# EAGLE design draft1 (EAGLE 8.4.0)
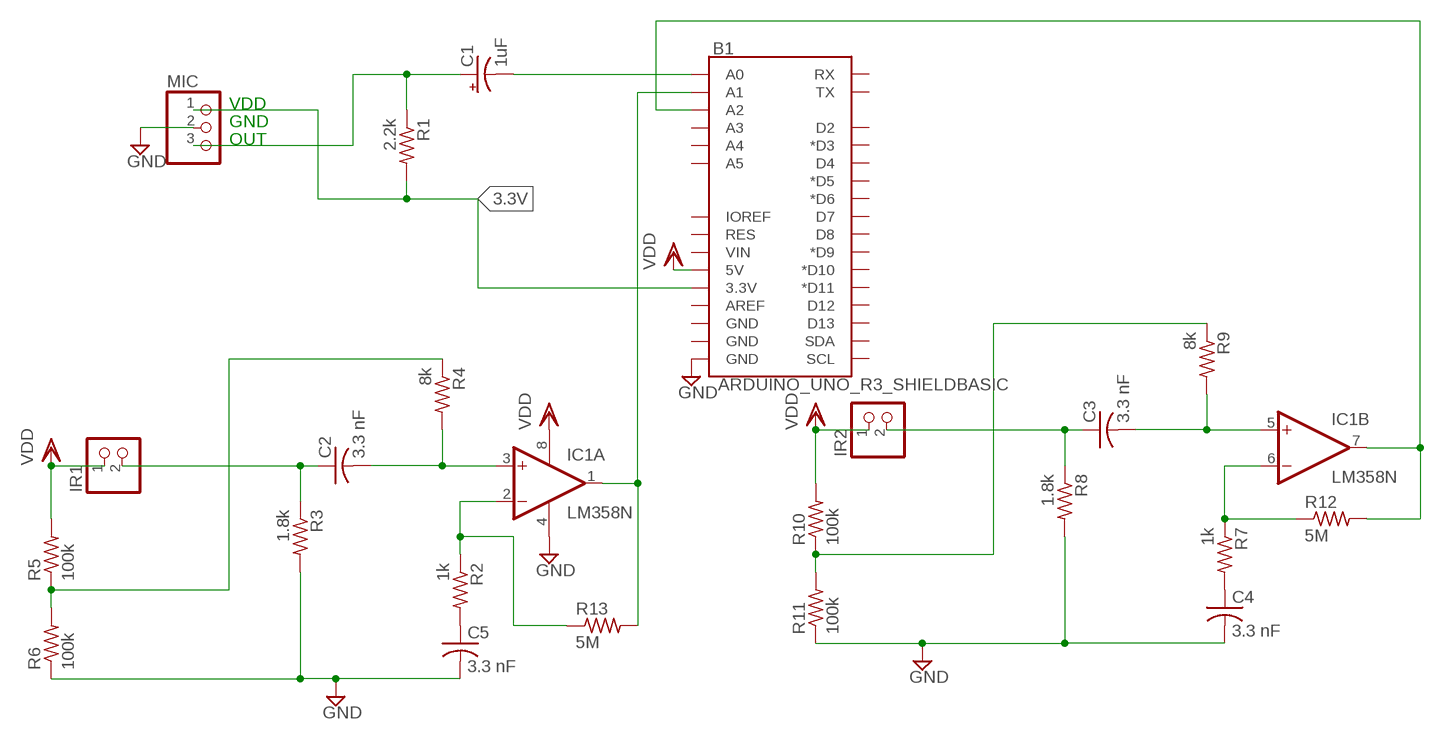
[diagram p0: schematic, sheet 1]

## Parts
B1  ARDUINO_UNO_R3_SHIELDBASIC  [UNO_R3_SHIELD]
C1  1uF  CPOL-USE5-6  [E5-6]
C2  3.3 nF  C-US025-040X050  [C025-040X050]
C3  3.3 nF  C-US025-040X050  [C025-040X050]
C4  3.3 nF  C-US025-040X050  [C025-040X050]
C5  3.3 nF  C-US025-040X050  [C025-040X050]
IC1  LM358N  [DIL08]
IR1  PINHD-1X2  [1X02]
IR2  PINHD-1X2  [1X02]
MIC  PINHD-1X3  [1X03]
R1  2.2k  R-US_0207/7  [0207/7]
R2  1k  R-US_0207/7  [0207/7]
R3  1.8k  R-US_0207/7  [0207/7]
R4  8k  R-US_0207/7  [0207/7]
R5  100k  R-US_0207/7  [0207/7]
R6  100k  R-US_0207/7  [0207/7]
R7  1k  R-US_0207/7  [0207/7]
R8  1.8k  R-US_0207/7  [0207/7]
R9  8k  R-US_0207/7  [0207/7]
R10  100k  R-US_0207/7  [0207/7]
R11  100k  R-US_0207/7  [0207/7]
R12  5M  R-US_0207/7  [0207/7]
R13  5M  R-US_0207/7  [0207/7]

## Nets
3.3V: B1.3.3V MIC.1 R1.2
GND: B1.GND@0(GND) C4.2 C5.2 IC1.4(P:V-) MIC.2 R3.2 R6.1 R8.2 R11.1
N$2: B1.A0 C1.-
N$3: C1.+ MIC.3 R1.1
N$4: B1.A2 IC1.7(B:OUT) R12.2
N$5: C4.1 R7.2
N$6: C3.1 IR2.2 R8.1
N$7: B1.A1 IC1.1(A:OUT) R13.2
N$8: C2.2 IC1.3(A:+IN) R4.2
N$9: IC1.6(B:-IN) R7.1 R12.1
N$11: C3.2 IC1.5(B:+IN) R9.2
N$12: IC1.2(A:-IN) R2.1 R13.1
N$14: R9.1 R10.1 R11.2
N$16: R4.1 R5.1 R6.2
N$17: C5.1 R2.2
N$18: C2.1 IR1.2 R3.1
VDD: B1.5V IC1.8(P:V+) IR1.1 IR2.1 R5.2 R10.2
Unconnected: B1.A3 B1.A4 B1.A5 B1.AREF B1.D2 B1.D3(*D3) B1.D4 B1.D5(*D5) B1.D6(*D6) B1.D7 B1.D8 B1.D9(*D9) B1.D10(*D10) B1.D11(*D11) B1.D12 B1.D13 B1.GND@1(GND) B1.GND@2(GND) B1.IOREF B1.RES B1.RX B1.SCL B1.SDA B1.TX B1.VIN

## Notes on the sheet
- VDD
- GND
- OUT

## Library data of the parts
B1 = SparkFun-Boards:ARDUINO_UNO_R3_SHIELD: Arduino R3 Shield Footprint Shield form compatible with the Arduino Uno R3. SparkFun Products: MG2639 Cellular Shield <https://www.sparkfun.com/products/13120> MIDI Shield <https://www.sparkfun.com/products/12898> R3 Stackable Headers Kit <https://www.sparkfun.com/products/11417>
C1 = resistor:CPOL-US: POLARIZED CAPACITOR, American symbol
C2-C5 = adafruit:C-US: CAPACITOR, American symbol
IC1 = linear:LM358: OP AMP also LM158; LM258; LM2904 Source: http://cache.national.com/ds/LM/LM158.pdf
IR1 IR2 = pinhead:PINHD-1X2: PIN HEADER
MIC = adafruit:PINHD-1X3: PIN HEADER
R1-R4 R7-R9 R12 R13 = rcl:R-US_: RESISTOR, American symbol
R5 R6 R10 R11 = adafruit:R-US_: RESISTOR, American symbol

## Net classes
0 default: width 0.61 mm

## Board
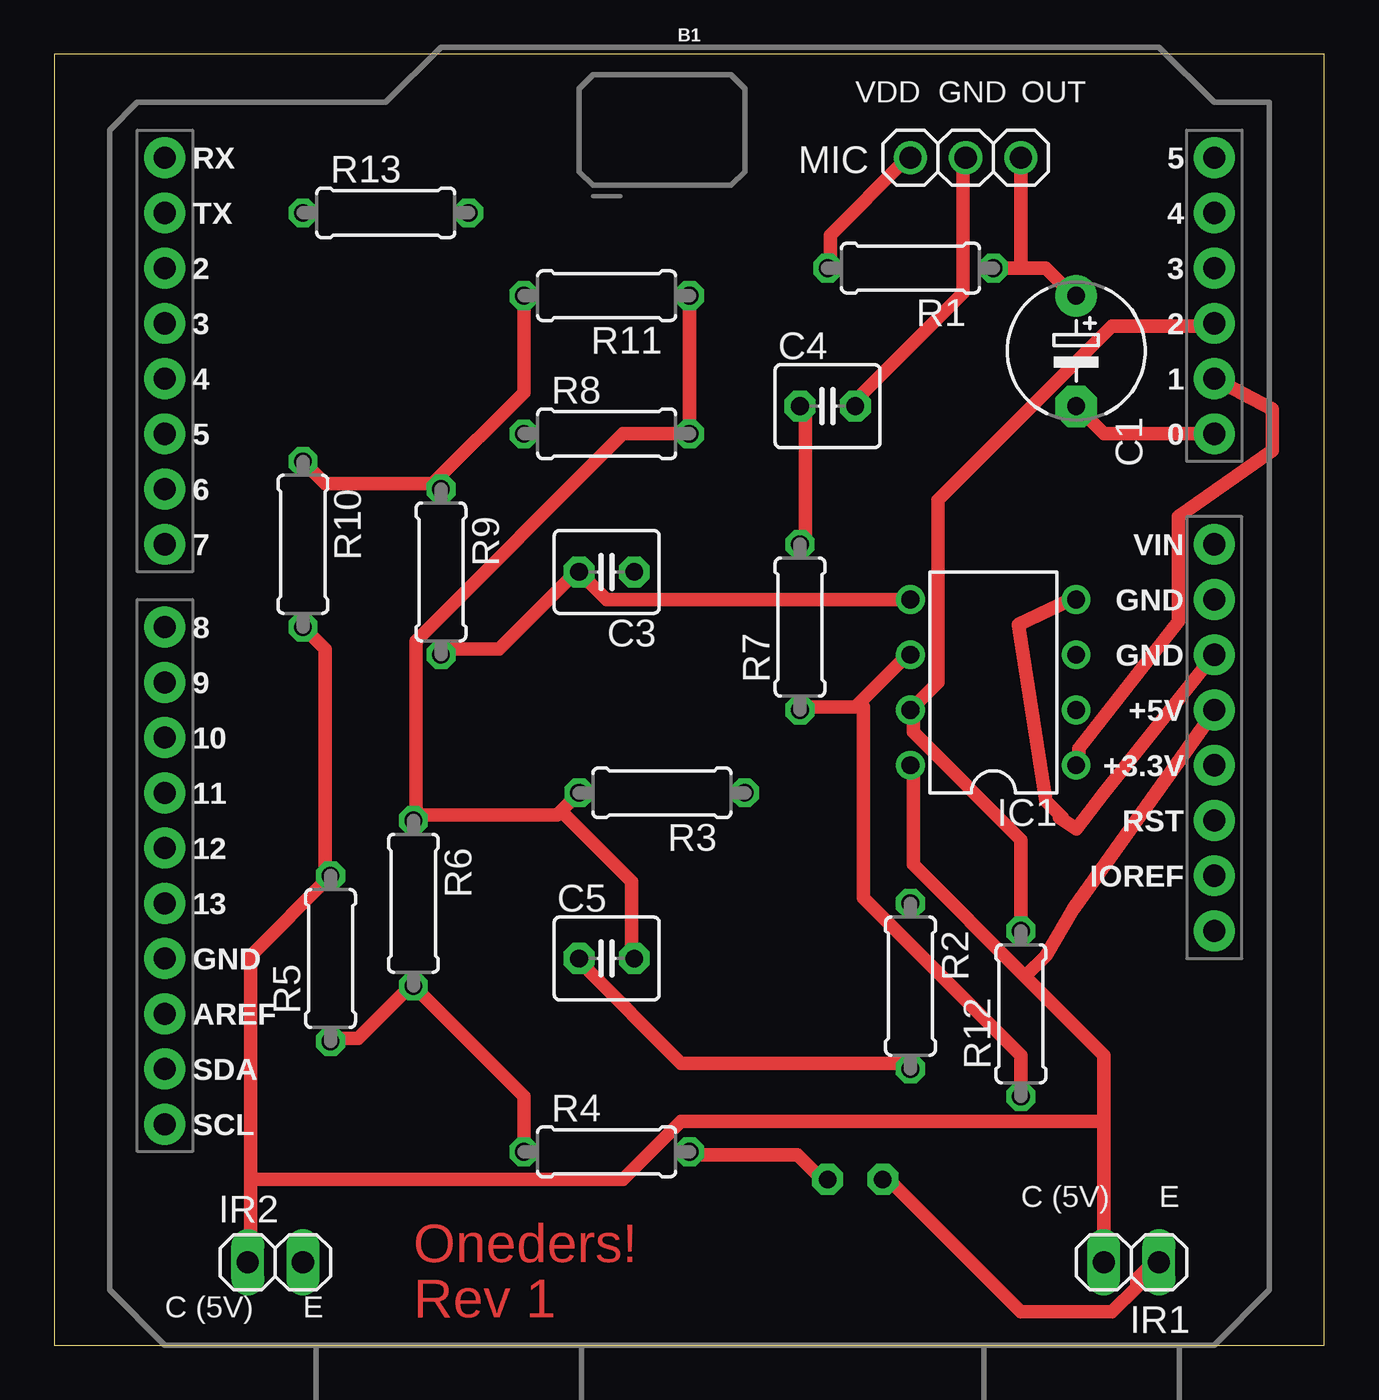
[diagram p1: board, top side]
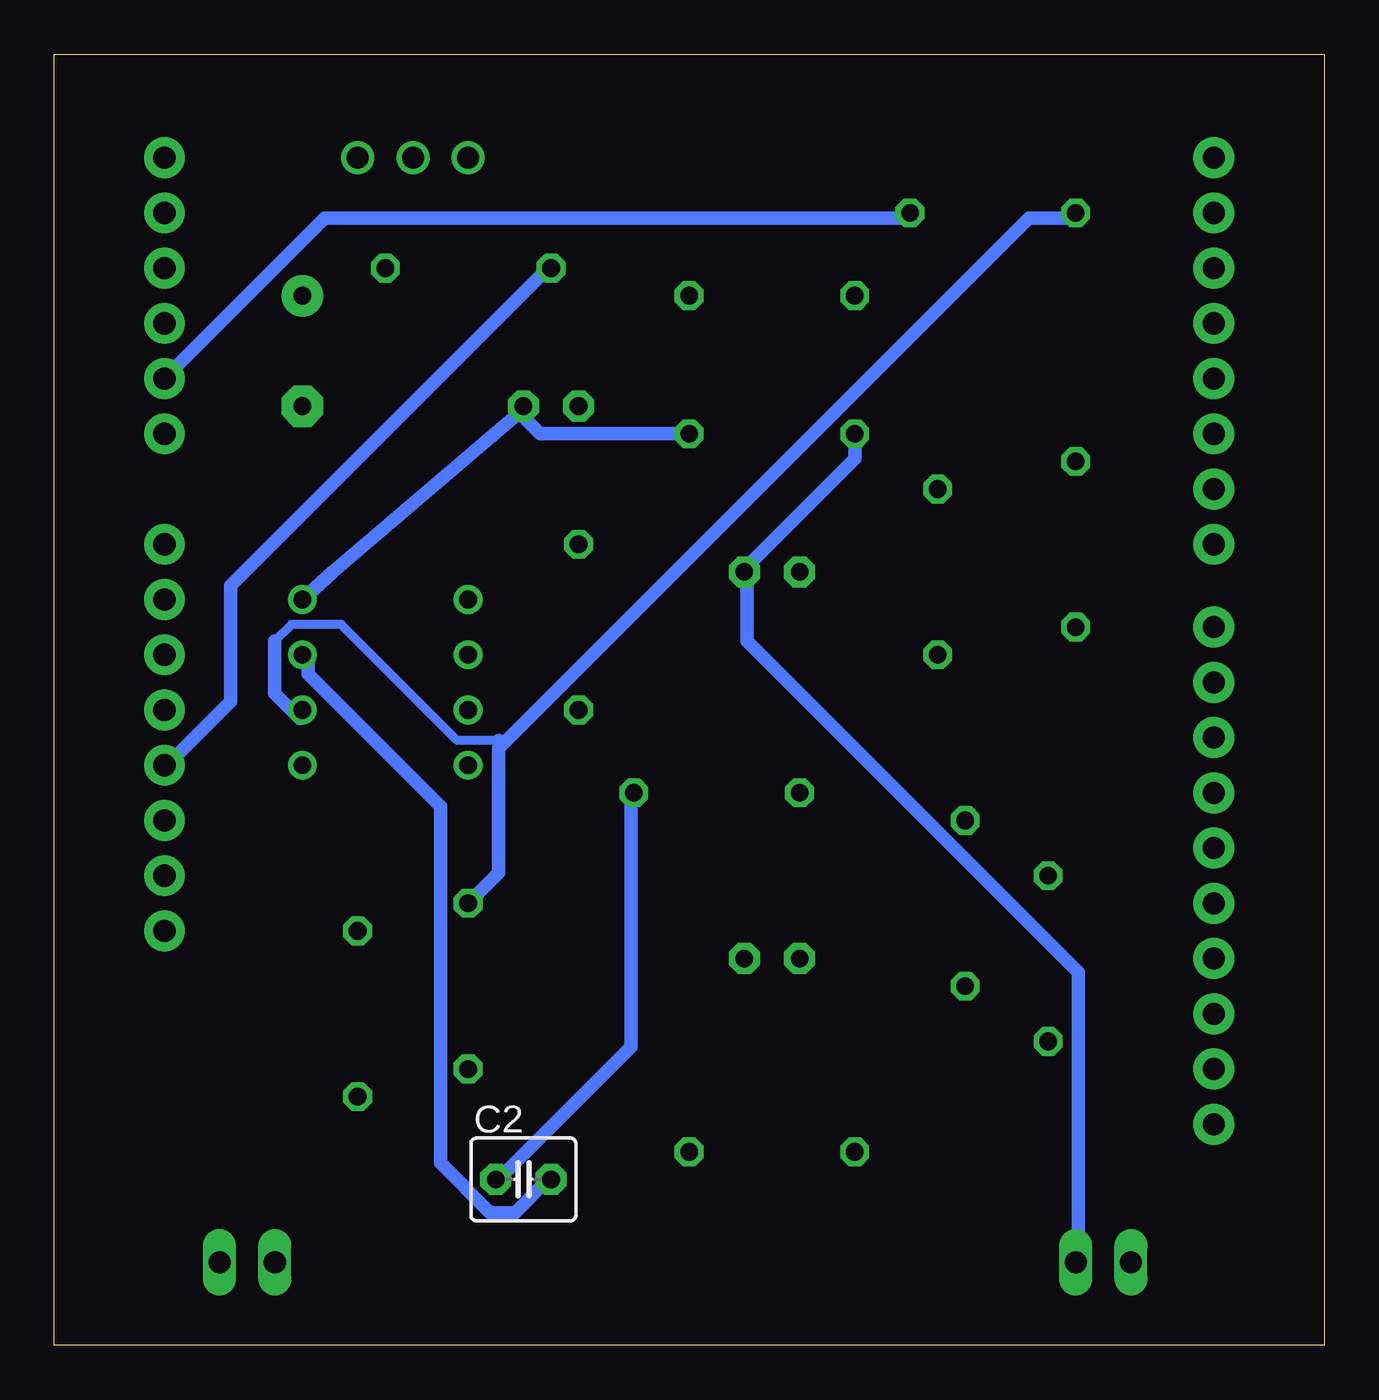
[diagram p2: board, bottom side, seen from below]

Size 58.4 x 59.36 mm. Coordinates in mm from the lower left corner, seen from the top.
Outline: 0,0 58.4,0 58.4,59.36 0,59.36 0,0
Copper layers (1*16): Top 0.035mm / dielectric 1.5mm / Bottom 0.035mm
Design rules "default": minimum track width 6mil, minimum drill 0.35mm, track to track 6mil, track to pad 6mil, pad to pad 6mil, via to via 6mil, smd to smd 6mil, copper to edge 40mil, drill to drill 6mil, minimum pad ring 10mil, minimum via ring 8mil, stop-mask expansion 4mil, vias tented up to drill 0mil, thermal gap 10mil

### Footprints (pad centres in the part's own frame; a part is rotated, then mirrored left to right if it is on the bottom)
UNO_R3_SHIELD = drill 1.016 pad 1.88: 3.3V 24.13,-2.54; 5V 24.13,0; A0 24.13,12.7; A1 24.13,15.24; A2 24.13,17.78; A3 24.13,20.32; A4 24.13,22.86; A5 24.13,25.4; AREF -24.13,-13.97; D2 -24.13,20.32; D3 -24.13,17.78; D4 -24.13,15.24; D5 -24.13,12.7; D6 -24.13,10.16; D7 -24.13,7.62; D8 -24.13,3.81; D9 -24.13,1.27; D10 -24.13,-1.27; D11 -24.13,-3.81; D12 -24.13,-6.35; D13 -24.13,-8.89; GND@0 24.13,2.54; GND@1 24.13,5.08; GND@2 -24.13,-11.43; IOREF 24.13,-7.62; NC 24.13,-10.16; RES 24.13,-5.08; RX -24.13,25.4; SCL -24.13,-19.05; SDA -24.13,-16.51; TX -24.13,22.86; VIN 24.13,7.62
E5-6 = drill 0.813 pad 1.905: + -2.54,0 | drill 0.813 pad 1.905 octagon: - 2.54,0
C025-040X050 = drill 0.813 pad 1.422 octagon: 1 -1.27,0; 2 1.27,0
DIL08 = drill 0.813 pad 1.27: 1 -3.81,-3.81; 2 -1.27,-3.81; 3 1.27,-3.81; 4 3.81,-3.81; 5 3.81,3.81; 6 1.27,3.81; 7 -1.27,3.81; 8 -3.81,3.81
1X02 = drill 1.016 long: 1 -1.27,0; 2 1.27,0
1X03 = drill 1.016: 1 -2.54,0; 2 0,0; 3 2.54,0
0207/7 = drill 0.813 octagon: 1 -3.81,0; 2 3.81,0

### Placement (x,y rotation side)
B1  29.21,29.21 0 top
C1  46.99,45.72 270 top
C2  36.83,7.62 0 bottom
C3  25.4,35.56 180 top
C4  35.56,43.18 0 top
C5  25.4,17.78 0 top
IC1  43.18,30.48 90 top
IR1  49.53,3.81 0 top
IR2  10.16,3.81 0 top
MIC  41.91,54.61 0 top
R1  39.37,49.53 180 top
R2  39.37,16.51 270 top
R3  27.94,25.4 180 top
R4  25.4,8.89 0 top
R5  12.7,17.78 90 top
R6  16.51,20.32 270 top
R7  34.29,33.02 90 top
R8  25.4,41.91 0 top
R9  17.78,35.56 270 top
R10  11.43,36.83 270 top
R11  25.4,48.26 180 top
R12  44.45,15.24 90 top
R13  15.24,52.07 0 top

### Tracks (layer width: path | path; a pad name or v marks a point on that pad's centre or on a via)
3.3V
  Top 0.61: R1.2 35.69,49.53 35.69,51.05 39.12,54.48 MIC.1
  Bottom 0.61: B1.3.3V 53.21,26.67 50.29,29.59 50.29,34.92 35.69,49.53 R1.2
GND
  Top 0.61: 16.64,24.38 23.11,24.38 23.3,24.57 | R3.2 23.3,24.57 | 23.3,24.57 26.54,21.34 26.54,17.91 C5.2 | R11.1 R8.2 26.16,41.91 16.64,32.39 16.64,24.38 | MIC.2 41.78,54.48 41.78,48.39 36.83,43.43 C4.2 | B1.GND@0 48.26,25.4 46.99,23.75 46.23,24.26 46.35,24.26 45.59,25.02 44.32,33.15 46.74,34.29 IC1.4 | 16.64,24.38 R6.1
  Bottom 0.61: IC1.4 45.59,35.56 36.83,43.05 | R8.2 36.07,41.91 36.83,42.67 36.83,43.05 | 36.83,43.05 C4.2
N$2
  Top 0.61: B1.A0 48.26,41.91 C1.-
N$3
  Top 0.61: 44.45,49.53 45.59,49.53 46.74,48.39 C1.+ | 44.45,49.53 R1.1 | 44.45,49.53 MIC.3
N$4
  Top 0.61: R12.2 44.45,23.24 39.5,28.19 39.5,28.96 IC1.7 40.64,30.48 40.64,38.86 48.64,46.86 53.21,46.86 B1.A2
N$5
  Top 0.61: R7.2 34.54,36.96 34.54,43.05 C4.1
N$6
  Bottom 0.61: R8.1 21.59,40.77 26.54,35.81 C3.1 26.54,35.43 26.54,32.39 11.3,17.14 11.3,3.81 IR2.2
N$7
  Top 0.61: B1.A1 56.01,43.05 56.01,41.15 51.69,38.1 51.69,33.27 47.12,27.43 47.12,26.67 IC1.1
  Bottom 0.61: B1.A1 45.97,51.82 19.3,51.82 R13.2
N$8
  Top 0.61: R4.2 29.21,8.76 34.16,8.76 35.31,7.62 C2.2
  Bottom 0.61: IC1.3 46.74,31.62 46.74,30.86 40.64,24.76 40.64,8.38 38.35,6.1 37.21,6.1 35.69,7.62 C2.2
N$9
  Top 0.61: 37.02,29.53 39.12,31.62 IC1.6 | 37.02,29.53 36.83,29.34 34.54,29.34 R7.1 | R12.1 44.45,13.33 37.21,20.57 37.21,29.34 37.02,29.53
N$11
  Top 0.61: R9.2 17.78,32 20.45,32 23.88,35.43 C3.2 25.4,34.29 IC1.5
N$12
  Bottom 0.406: 48.26,32.39 47.5,33.15 45.21,33.15 39.88,27.81 37.97,27.81
  Bottom 0.61: 37.78,27.62 37.97,27.43 37.97,21.72 R2.1 | 37.78,27.62 13.59,51.82 11.68,51.82 R13.1 | 48.26,32.39 48.26,29.97 47.12,28.83 47.12,29.34 IC1.2 | 37.97,27.81 37.78,27.62
N$14
  Top 0.61: 17.4,39.62 12.45,39.62 R10.1 | 17.4,39.62 17.78,39.62 R9.1 17.4,39.62 | R11.2 21.59,43.81 17.4,39.62
N$16
  Top 0.61: R4.1 21.59,11.43 R6.2 16.26,16.38 13.97,14.1 12.83,14.1 R5.1
N$17
  Top 0.61: R2.2 39.12,12.95 28.83,12.95 24.26,17.53 C5.1
N$18
  Top 0.61: IR1.2 50.55,3.81 49.78,3.05 49.78,2.67 48.64,1.52 44.45,1.52 38.35,7.62 C2.1
  Bottom 0.61: R3.1 31.88,25.15 31.88,13.72 37.97,7.62 C2.1
VDD
  Top 0.61: R10.2 12.45,32 12.45,21.72 R5.2 9.02,17.91 9.02,7.62 | 9.02,7.62 9.02,3.81 IR2.1 | 44.64,16.96 48.26,13.33 48.26,10.29 | 44.64,16.96 39.5,22.1 39.5,26.67 IC1.8 | IR1.1 48.26,10.29 | 44.64,16.96 45.59,17.91 46.86,20.07 53.21,28.96 B1.5V | 9.02,7.62 26.16,7.62 28.83,10.29 48.26,10.29

### Text on the board
Top: Oneders! | Rev 1
_tNames: VDD | GND | OUT | C (5V) | E | C (5V) | E